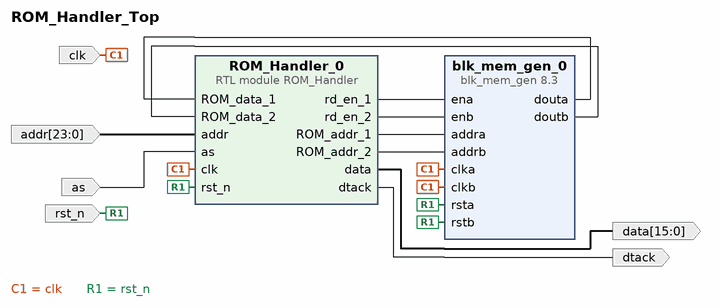
[diagram p0: block diagram of the top level]
# Vivado block design ROM_Handler_Top, Vivado 2016.2
create_bd_design ROM_Handler_Top

create_bd_port -dir I -type clk clk
create_bd_port -dir I rst_n
create_bd_port -dir I -from 23 -to 0 -type data addr
create_bd_port -dir O dtack
create_bd_port -dir I as
create_bd_port -dir O -from 15 -to 0 -type data data

create_bd_cell -type ip -vlnv xilinx.com:ip:blk_mem_gen:8.3 blk_mem_gen_0
set_property -dict [list \
  CONFIG.Memory_Type Dual_Port_ROM \
  CONFIG.Enable_32bit_Address false \
  CONFIG.Assume_Synchronous_Clk true \
  CONFIG.Write_Width_A 8 \
  CONFIG.Write_Depth_A 524288 \
  CONFIG.Write_Width_B 8 \
  CONFIG.Read_Width_B 8 \
  CONFIG.Enable_B Use_ENB_Pin \
  CONFIG.Register_PortA_Output_of_Memory_Primitives true \
  CONFIG.Register_PortB_Output_of_Memory_Primitives true \
  CONFIG.Load_Init_File true \
  CONFIG.Coe_File {../../../../../../../Sonic the Hedgehog.bin.coe} \
  CONFIG.Fill_Remaining_Memory_Locations true \
  CONFIG.Use_RSTA_Pin true \
  CONFIG.Use_RSTB_Pin true \
  CONFIG.Port_A_Write_Rate 0 \
  CONFIG.Port_B_Clock 100 \
  CONFIG.Port_B_Enable_Rate 100 \
  CONFIG.Disable_Collision_Warnings false \
  CONFIG.use_bram_block Stand_Alone \
] [get_bd_cells blk_mem_gen_0]
create_bd_cell -type module -reference ROM_Handler ROM_Handler_0

# ---- connections ----

connect_bd_net [get_bd_ports clk] [get_bd_pins blk_mem_gen_0/clka] [get_bd_pins blk_mem_gen_0/clkb] [get_bd_pins ROM_Handler_0/clk]
connect_bd_net [get_bd_ports rst_n] [get_bd_pins blk_mem_gen_0/rsta] [get_bd_pins blk_mem_gen_0/rstb] [get_bd_pins ROM_Handler_0/rst_n]
connect_bd_net [get_bd_pins ROM_Handler_0/rd_en_1] [get_bd_pins blk_mem_gen_0/ena]
connect_bd_net [get_bd_pins ROM_Handler_0/rd_en_2] [get_bd_pins blk_mem_gen_0/enb]
connect_bd_net [get_bd_pins ROM_Handler_0/ROM_addr_1] [get_bd_pins blk_mem_gen_0/addra]
connect_bd_net [get_bd_pins ROM_Handler_0/ROM_addr_2] [get_bd_pins blk_mem_gen_0/addrb]
connect_bd_net [get_bd_pins blk_mem_gen_0/douta] [get_bd_pins ROM_Handler_0/ROM_data_1]
connect_bd_net [get_bd_pins blk_mem_gen_0/doutb] [get_bd_pins ROM_Handler_0/ROM_data_2]
connect_bd_net [get_bd_ports addr] [get_bd_pins ROM_Handler_0/addr]
connect_bd_net [get_bd_pins ROM_Handler_0/dtack] [get_bd_ports dtack]
connect_bd_net [get_bd_ports as] [get_bd_pins ROM_Handler_0/as]
connect_bd_net [get_bd_pins ROM_Handler_0/data] [get_bd_ports data]

validate_bd_design
save_bd_design
